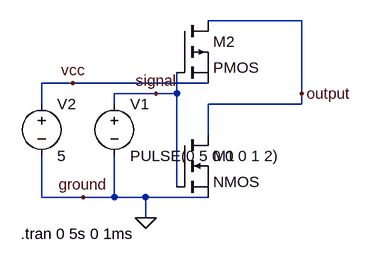
[diagram p0: schematic NotGate.asc]
NotGate.asc, the LTspice schematic file:
Version 4
SHEET 1 880 680
WIRE 368 16 224 16
WIRE 16 112 -32 112
WIRE 224 112 16 112
WIRE 144 128 80 128
WIRE 176 128 176 96
WIRE 176 128 144 128
WIRE 368 128 368 16
WIRE -32 144 -32 112
WIRE 80 144 80 128
WIRE 368 144 368 128
WIRE 368 144 224 144
WIRE 224 192 224 144
WIRE 176 272 176 128
WIRE -32 288 -32 224
WIRE 32 288 -32 288
WIRE 80 288 80 224
WIRE 80 288 32 288
WIRE 128 288 80 288
WIRE 224 288 128 288
WIRE 128 320 128 288
FLAG 128 320 0
FLAG 368 128 output
FLAG 144 128 signal
FLAG 16 112 vcc
FLAG 32 288 ground
SYMBOL nmos 176 192 R0
SYMATTR InstName M1
SYMBOL pmos 176 16 R0
SYMATTR InstName M2
SYMBOL voltage 80 128 R0
WINDOW 123 0 0 Left 2
WINDOW 39 0 0 Left 2
SYMATTR InstName V1
SYMATTR Value PULSE(0 5 0 0 0 1 2)
SYMBOL voltage -32 128 R0
WINDOW 123 0 0 Left 2
WINDOW 39 0 0 Left 2
SYMATTR InstName V2
SYMATTR Value 5
TEXT -64 344 Left 2 !.tran 0 5s 0 1ms

The netlist it stands for:
* NotGate.asc
M1 output signal 0 0 NMOS
M2 output signal vcc vcc PMOS
V1 signal 0 PULSE(0 5 0 0 0 1 2)
V2 vcc 0 5
.model NMOS NMOS
.model PMOS PMOS
.lib standard.mos
.tran 0 5s 0 1ms
.backanno
.end